# EAGLE design processor (EAGLE 5.11)
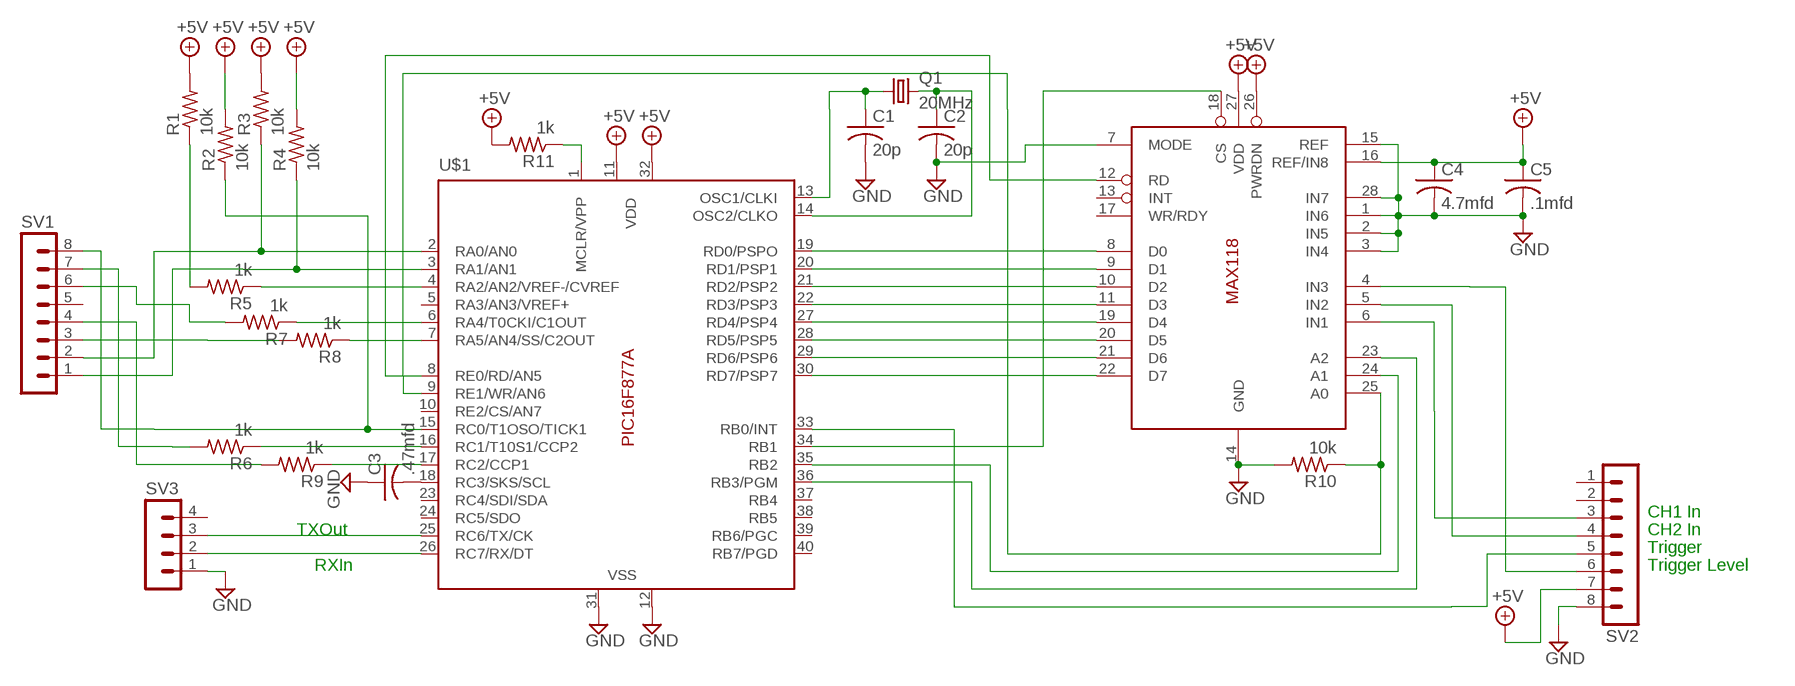
[diagram p0: schematic, sheet 1]

## Parts
C1  20p  C-US050-025X075  [C050-025X075]
C2  20p  C-US050-025X075  [C050-025X075]
C3  .47mfd  C-US050-025X075  [C050-025X075]
C4  4.7mfd  C-US050-025X075  [C050-025X075]
C5  .1mfd  C-US050-025X075  [C050-025X075]
Q1  20MHz  CRYSTALHC49U70  [HC49U70]
R1  10k  R-US_0204/7  [0204/7]
R2  10k  R-US_0204/7  [0204/7]
R3  10k  R-US_0204/7  [0204/7]
R4  10k  R-US_0204/7  [0204/7]
R5  1k  R-US_0204/7  [0204/7]
R6  1k  R-US_0204/7  [0204/7]
R7  1k  R-US_0204/7  [0204/7]
R8  1k  R-US_0204/7  [0204/7]
R9  1k  R-US_0204/7  [0204/7]
R10  10k  R-US_0204/7  [0204/7]
R11  1k  R-US_0204/7  [0204/7]
SV1  MA08-1  [MA08-1]
SV2  MA08-1  [MA08-1]
SV3  MA04-1  [MA04-1]
U$1  PIC16F877A  [DIL40]
U$2  NAX118  [DIL28-6]

## Nets
+5V: C4.1 C5.1 R1.2 R2.2 R3.2 R4.2 R11.2 SV2.7 U$1.11(VDD) U$1.32(VDD1) U$2.16(REF/IN8) U$2.26(PWRDN) U$2.27(VDD)
GND: C1.2 C2.2 C3.1 C4.2 C5.2 R10.2 SV2.8 SV3.1 U$1.12(VSS) U$1.31(VSS2) U$2.1(IN6) U$2.2(IN5) U$2.3(IN4) U$2.7(MODE) U$2.14(GND) U$2.15(REF) U$2.28(IN7)
N$1: R9.2 SV1.4
N$2: R7.1 U$1.6(RA4/T0CKI/C1OUT)
N$3: R3.1 SV1.2 U$1.2(RA0/AN0)
N$4: R4.1 SV1.1 U$1.3(RA1/AN1)
N$5: R1.1 R5.2
N$6: R5.1 U$1.4(RA2/AN2/VREF-/CVREF)
N$7: R8.1 U$1.7(RA5/AN4/SS/C2OUT)
N$8: C3.2 U$1.18(RC3/SKS/SCL)
N$9: U$1.19(RD0/PSPO) U$2.8(D0)
N$10: R11.1 U$1.1(MCLR/VPP)
N$11: C1.1 Q1.1 U$1.13(OSC1/CLKI)
N$12: C2.1 Q1.2 U$1.14(OSC2/CLKO)
N$13: R8.2 SV1.3
N$14: R10.1 U$1.9(RE1/WR/AN6) U$2.25(A0)
N$15: U$1.8(RE0/RD/AN5) U$2.12(RD)
N$16: R6.1 U$1.16(RC1/T10S1/CCP2)
N$17: R9.1 U$1.17(RC2/CCP1)
N$18: R6.2 SV1.7
N$19: R7.2 SV1.6
N$20: SV3.3 U$1.25(RC6/TX/CK)
N$21: SV3.2 U$1.26(RC7/RX/DT)
N$22: U$1.20(RD1/PSP1) U$2.9(D1)
N$23: U$1.21(RD2/PSP2) U$2.10(D2)
N$24: U$1.22(RD3/PSP3) U$2.11(D3)
N$25: U$1.27(RD4/PSP4) U$2.19(D4)
N$26: U$1.28(RD5/PSP5) U$2.20(D5)
N$27: U$1.29(RD6/PSP6) U$2.21(D6)
N$28: U$1.30(RD7/PSP7) U$2.22(D7)
N$29: U$1.34(RB1) U$2.18(CS)
N$30: U$1.35(RB2) U$2.24(A1)
N$31: U$1.36(RB3/PGM) U$2.23(A2)
N$33: SV2.6 U$2.4(IN3)
N$34: SV2.5 U$1.33(RB0/INT)
N$35: SV2.3 U$2.6(IN1)
N$36: SV2.4 U$2.5(IN2)
N$37: R2.1 SV1.8 U$1.15(RC0/T1OSO/TICK1)
Unconnected: SV1.5 SV2.1 SV2.2 SV3.4 U$1.5(RA3/AN3/VREF+) U$1.10(RE2/CS/AN7) U$1.23(RC4/SDI/SDA) U$1.24(RC5/SDO) U$1.37(RB4) U$1.38(RB5) U$1.39(RB6/PGC) U$1.40(RB7/PGD) U$2.13(INT) U$2.17(WR/RDY)

## Notes on the sheet
- CH1 In
- TXOut | CH2 In
- Trigger
- RXIn | Trigger Level

## Library data of the parts
C1-C5 = resistor:C-US: CAPACITOR, American symbol
Q1 = crystal:CRYSTAL: CRYSTAL; OC_FARNELL: unknown; OC_NEWARK: unknown
R1-R11 = resistor:R-US_: RESISTOR, American symbol
SV1 SV2 = con-lstb:MA08-1: PIN HEADER; OC_FARNELL: unknown; OC_NEWARK: unknown
SV3 = con-lstb:MA04-1: PIN HEADER; OC_FARNELL: unknown; OC_NEWARK: unknown
U$1 = DENS:PIC16F877A
U$2 = DENS:NAX118

## Board
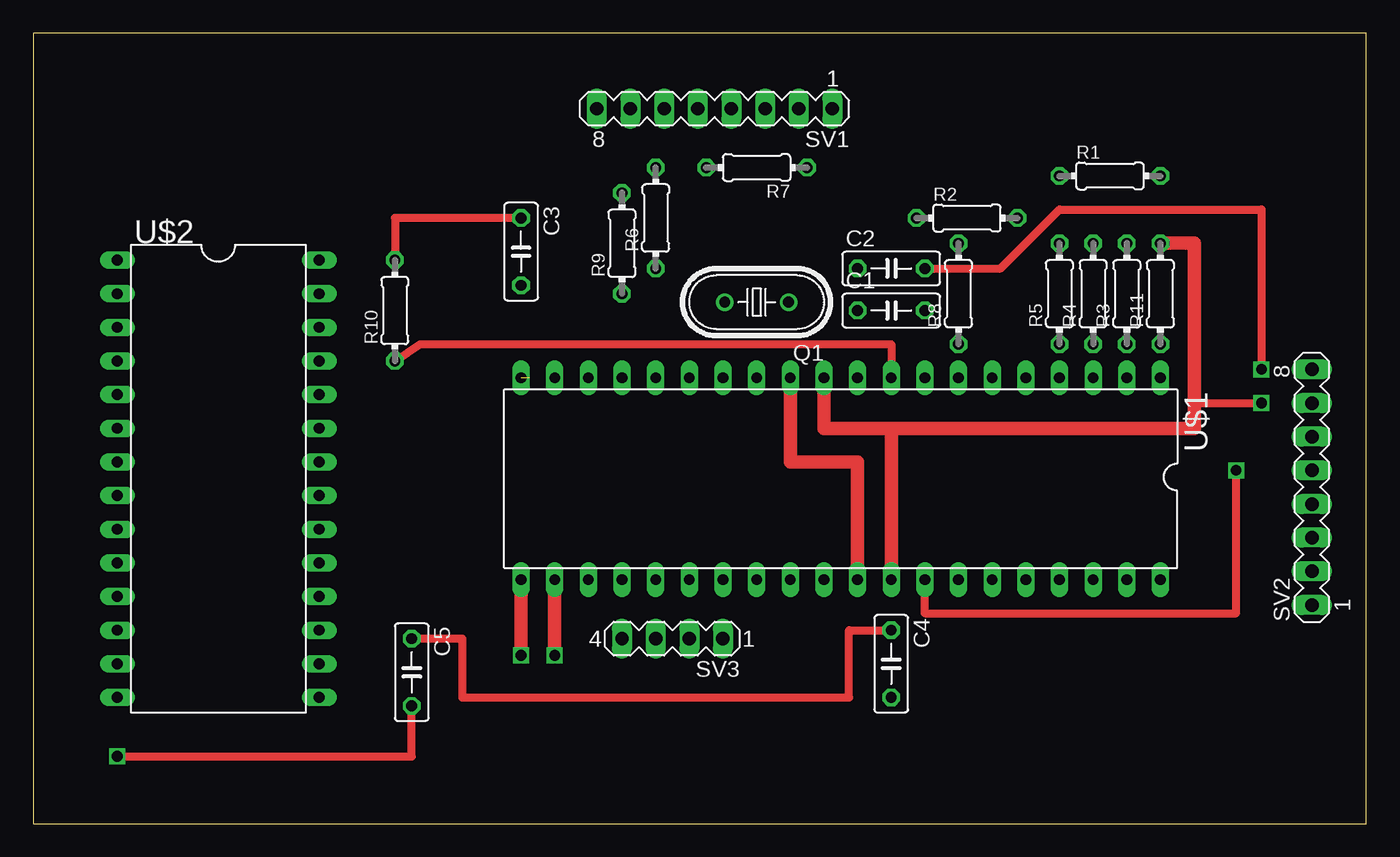
[diagram p1: board, top side]
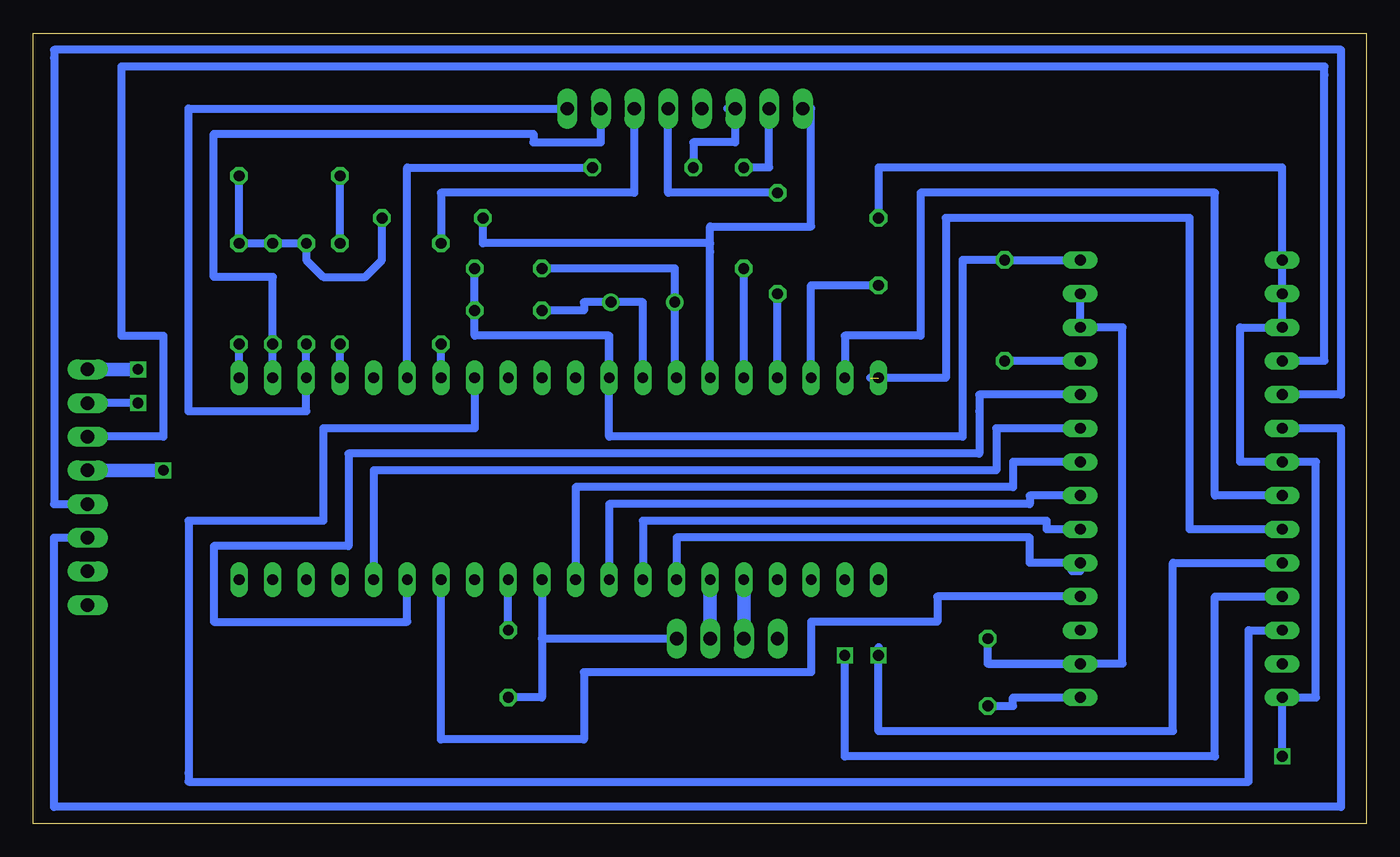
[diagram p2: board, bottom side, seen from below]

Size 100.64 x 59.68 mm. Coordinates in mm from the lower left corner, seen from the top.
Outline: 0,0 100.64,0 100.64,59.68 0,59.68 0,0
Copper layers (1*16): Top 0.035mm / dielectric 1.5mm / Bottom 0.035mm
Design rules "025mill": minimum track width 10mil, minimum drill 24mil, track to track 25mil, track to pad 25mil, pad to pad 25mil, via to via 25mil, smd to smd 25mil, copper to edge 25mil, drill to drill 8mil, minimum pad ring 10mil, minimum via ring 8mil, stop-mask expansion 4mil, vias tented up to drill 0mil, thermal gap 10mil

### Footprints (pad centres in the part's own frame; a part is rotated, then mirrored left to right if it is on the bottom)
C050-025X075 = drill 0.813 octagon: 1 -2.54,0; 2 2.54,0
HC49U70 = drill 0.813 round: 1 -2.413,0; 2 2.413,0
0204/7 = drill 0.813 octagon: 1 -3.81,0; 2 3.81,0
MA08-1 = drill 1.016 long: 1 -8.89,0; 2 -6.35,0; 3 -3.81,0; 4 -1.27,0; 5 1.27,0; 6 3.81,0; 7 6.35,0; 8 8.89,0
MA04-1 = drill 1.016 long: 1 -3.81,0; 2 -1.27,0; 3 1.27,0; 4 3.81,0
DIL40 = drill 0.813 long: 1 -24.13,-7.62; 2 -21.59,-7.62; 3 -19.05,-7.62; 4 -16.51,-7.62; 5 -13.97,-7.62; 6 -11.43,-7.62; 7 -8.89,-7.62; 8 -6.35,-7.62; 9 -3.81,-7.62; 10 -1.27,-7.62; 11 1.27,-7.62; 12 3.81,-7.62; 13 6.35,-7.62; 14 8.89,-7.62; 15 11.43,-7.62; 16 13.97,-7.62; 17 16.51,-7.62; 18 19.05,-7.62; 19 21.59,-7.62; 20 24.13,-7.62; 21 24.13,7.62; 22 21.59,7.62; 23 19.05,7.62; 24 16.51,7.62; 25 13.97,7.62; 26 11.43,7.62; 27 8.89,7.62; 28 6.35,7.62; 29 3.81,7.62; 30 1.27,7.62; 31 -1.27,7.62; 32 -3.81,7.62; 33 -6.35,7.62; 34 -8.89,7.62; 35 -11.43,7.62; 36 -13.97,7.62; 37 -16.51,7.62; 38 -19.05,7.62; 39 -21.59,7.62; 40 -24.13,7.62
DIL28-6 = drill 0.813 long: 1 -16.51,-7.62; 2 -13.97,-7.62; 3 -11.43,-7.62; 4 -8.89,-7.62; 5 -6.35,-7.62; 6 -3.81,-7.62; 7 -1.27,-7.62; 8 1.27,-7.62; 9 3.81,-7.62; 10 6.35,-7.62; 11 8.89,-7.62; 12 11.43,-7.62; 13 13.97,-7.62; 14 16.51,-7.62; 15 16.51,7.62; 16 13.97,7.62; 17 11.43,7.62; 18 8.89,7.62; 19 6.35,7.62; 20 3.81,7.62; 21 1.27,7.62; 22 -1.27,7.62; 23 -3.81,7.62; 24 -6.35,7.62; 25 -8.89,7.62; 26 -11.43,7.62; 27 -13.97,7.62; 28 -16.51,7.62

### Placement (x,y rotation side)
C1  64.77,38.73 0 top
C2  64.77,41.91 0 top
C3  36.83,43.18 270 top
C4  64.77,12.06 270 top
C5  28.57,11.43 270 top
Q1  54.61,39.37 180 top
R1  81.28,48.9 0 top
R2  70.48,45.72 0 top
R3  82.55,40.01 90 top
R4  80.01,40.01 90 top
R5  77.47,40.01 90 top
R6  46.99,45.72 90 top
R7  54.61,49.53 180 top
R8  69.85,40.01 90 top
R9  44.45,43.81 90 top
R10  27.3,38.73 90 top
R11  85.09,40.01 90 top
SV1  51.44,53.98 180 top
SV2  96.52,25.4 90 top
SV3  48.26,13.97 180 top
U$1  60.96,26.04 180 top
U$2  13.97,26.04 270 top

### Tracks (layer width: path | path; a pad name or v marks a point on that pad's centre or on a via)
+5V  (via drill 0.8)
  Top 0.61: C5.1 32.38,13.97 32.38,9.53 61.59,9.53 61.59,14.61 C4.1 | 87.63,31.75 v92.71,31.75
  Top 1.016: U$1.11 59.69,29.84 64.77,29.84 | U$1.32 64.77,29.84 | R11.2 87.63,43.81 87.63,31.75 87.63,30.48 87.63,29.84 64.77,29.84
  Bottom 0.61: R1.2 R11.2 R3.2 R4.2 80.01,42.55 78.74,41.27 75.56,41.27 74.3,42.55 R2.2 | C4.1 U$1.32 | U$2.27 U$2.26 18.41,37.47 18.41,12.06 28.57,12.06 | 28.57,12.06 U$2.16 | 28.57,12.06 C5.1 28.57,12.06 | v92.71,31.75 SV2.7
GND  (via drill 0.8)
  Top 0.61: v92.71,34.29 92.71,46.35 77.47,46.35 73.66,42.55 73.03,41.91 C2.2 | v6.35,5.08 28.57,5.08 C5.2 | C3.1 27.3,45.72 R10.2
  Top 1.016: U$1.31 62.23,27.3 57.15,27.3 57.15,33.02 U$1.12
  Bottom 0.61: 57.15,36.83 U$1.12 | 57.15,36.83 67.31,36.83 C1.2 C2.2 | C4.2 62.23,9.53 62.23,13.97 | U$1.31 62.23,13.97 | U$2.14 5.08,9.53 | U$2.15 26.67,9.53 26.67,8.89 C5.2 | U$2.28 R10.2 30.48,42.55 30.48,29.21 57.15,29.21 57.15,36.83 | 62.23,13.97 SV3.1 | U$2.14 3.81,9.53 3.81,27.3 U$2.7 9.53,27.3 9.53,37.47 U$2.3 U$2.2 U$2.1 6.35,49.53 36.83,49.53 C3.1 | U$2.15 20.95,9.53 U$2.15 | v6.35,5.08 U$2.14
  Bottom 1.016: v92.71,34.29 SV2.8
N$1
  Bottom 0.61: R9.2 52.7,47.62 SV1.4
N$2
  Bottom 0.61: R7.1 72.39,49.53 U$1.6
N$3
  Bottom 0.61: U$1.2 R3.1 82.55,41.27 87,41.27 87,52.07 62.87,52.07 62.87,51.44 57.78,51.44 SV1.2
N$4
  Bottom 0.61: R4.1 U$1.3 80.01,31.11 88.9,31.11 88.9,53.98 SV1.1
N$5
  Bottom 0.61: R5.2 R1.1
N$6
  Bottom 0.61: U$1.4 R5.1
N$7
  Bottom 0.61: U$1.7 R8.1
N$8
  Bottom 0.61: U$1.18 41.91,40.64 C3.2
N$9
  Bottom 0.61: U$2.8 11.43,24.77 11.43,47.62 33.66,47.62 33.66,36.83 39.37,36.83 U$1.19
N$10
  Bottom 0.61: U$1.1 R11.1
N$11
  Bottom 0.61: C1.1 59.05,38.73 59.05,39.37 Q1.1 54.61,39.37 U$1.13
N$12
  Bottom 0.61: U$1.14 52.2,33.66 Q1.2 52.2,41.91 C2.1
N$13
  Bottom 0.61: R8.2 69.85,47.62 55.24,47.62 SV1.3
N$14
  Top 0.61: R10.1 29.21,36.2 45.72,36.2 64.77,36.2 U$1.9
  Bottom 0.61: U$2.25 26.67,34.92 R10.1
N$15
  Bottom 0.61: U$1.8 67.31,29.84 78.74,29.84 78.74,22.86 88.9,22.86 88.9,3.81 88.9,3.17 8.89,3.17 8.89,14.61 U$2.12
N$16
  Bottom 0.61: U$1.16 R6.1
N$17
  Bottom 0.61: U$1.17 R9.1
N$18
  Bottom 0.61: R6.2 45.09,49.53 SV1.7
N$19
  Bottom 0.61: SV1.6 48.26,53.98 SV1.6 | R7.2 50.8,51.44 47.62,51.44 SV1.6
N$20
  Bottom 1.016: SV3.3 U$1.25
N$21
  Bottom 1.016: SV3.2 U$1.26
N$22  (1 unrouted)
  Bottom 0.61: U$2.9 13.34,22.23 13.34,45.72 31.75,45.72 31.75,33.66 37.47,33.66
N$23  (via drill 0.8)
  Top 1.016: v36.83,12.7 U$1.21
  Bottom 0.61: U$2.10 14.61,19.68 14.61,6.99 36.83,6.99 v36.83,12.7 36.83,13.34
N$24  (via drill 0.8)
  Top 1.016: v39.37,12.7 U$1.22
  Bottom 0.61: U$2.11 11.43,17.14 11.43,5.08 39.37,5.08 v39.37,12.7
N$25
  Bottom 0.61: U$1.27 52.07,21.59 25.4,21.59 25.4,19.68 22.23,19.68 22.23,19.05 21.59,19.05 U$2.19
N$26
  Bottom 0.61: U$2.20 24.13,22.23 24.13,22.86 54.61,22.86 U$1.28
N$27
  Bottom 0.61: U$2.21 25.4,24.77 25.4,24.13 57.15,24.13 U$1.29
N$28
  Bottom 0.61: U$2.22 26.67,27.3 26.67,25.4 59.69,25.4 U$1.30
N$29
  Bottom 0.61: U$1.34 69.85,7.62 69.85,6.99 | 69.85,6.35 69.85,6.99 | 69.85,6.35 69.85,6.99 | U$2.18 22.23,17.14 U$2.18 | U$2.18 32.38,17.14 32.38,15.24 41.91,15.24 41.91,11.43 59.05,11.43 59.05,6.35 69.85,6.35
N$30
  Bottom 0.61: U$2.24 29.21,32.38 29.21,31.11 29.21,27.94 76.83,27.94 76.83,20.95 87,20.95 87,20.32 87,19.68 87,15.24 72.39,15.24 72.39,17.78 U$1.35
N$31
  Bottom 0.61: U$2.23 27.94,29.84 27.94,26.67 74.93,26.67 U$1.36
N$32  (via drill 0.8)
  other vias: 6.35,5.08
N$33
  Bottom 0.61: SV2.6 90.81,29.21 90.81,36.83 93.98,36.83 93.98,57.15 3.17,57.15 3.17,56.52 3.17,34.92 U$2.4
N$34  (via drill 0.8)
  Top 0.61: U$1.33 67.31,15.88 90.81,15.88 v90.81,26.67
  Bottom 1.016: v90.81,26.67 SV2.5
N$35
  Bottom 0.61: U$2.6 1.91,29.84 1.91,1.27 99.06,1.27 99.06,21.59 SV2.3
N$36
  Bottom 0.61: U$2.5 1.91,32.38 1.91,58.42 99.06,58.42 99.06,57.78 99.06,24.13 SV2.4
N$37
  Bottom 0.61: 49.53,43.81 66.67,43.81 R2.1 | 49.53,43.81 49.53,43.18 49.53,34.29 U$1.15 | SV1.8 41.91,53.98 41.91,45.09 49.53,45.09 49.53,43.81
N$38  (via drill 0.8)
  other vias: 92.71,31.75